# EAGLE design Nu2031 (EAGLE 7.7.0)

## Sheet 1 of 4
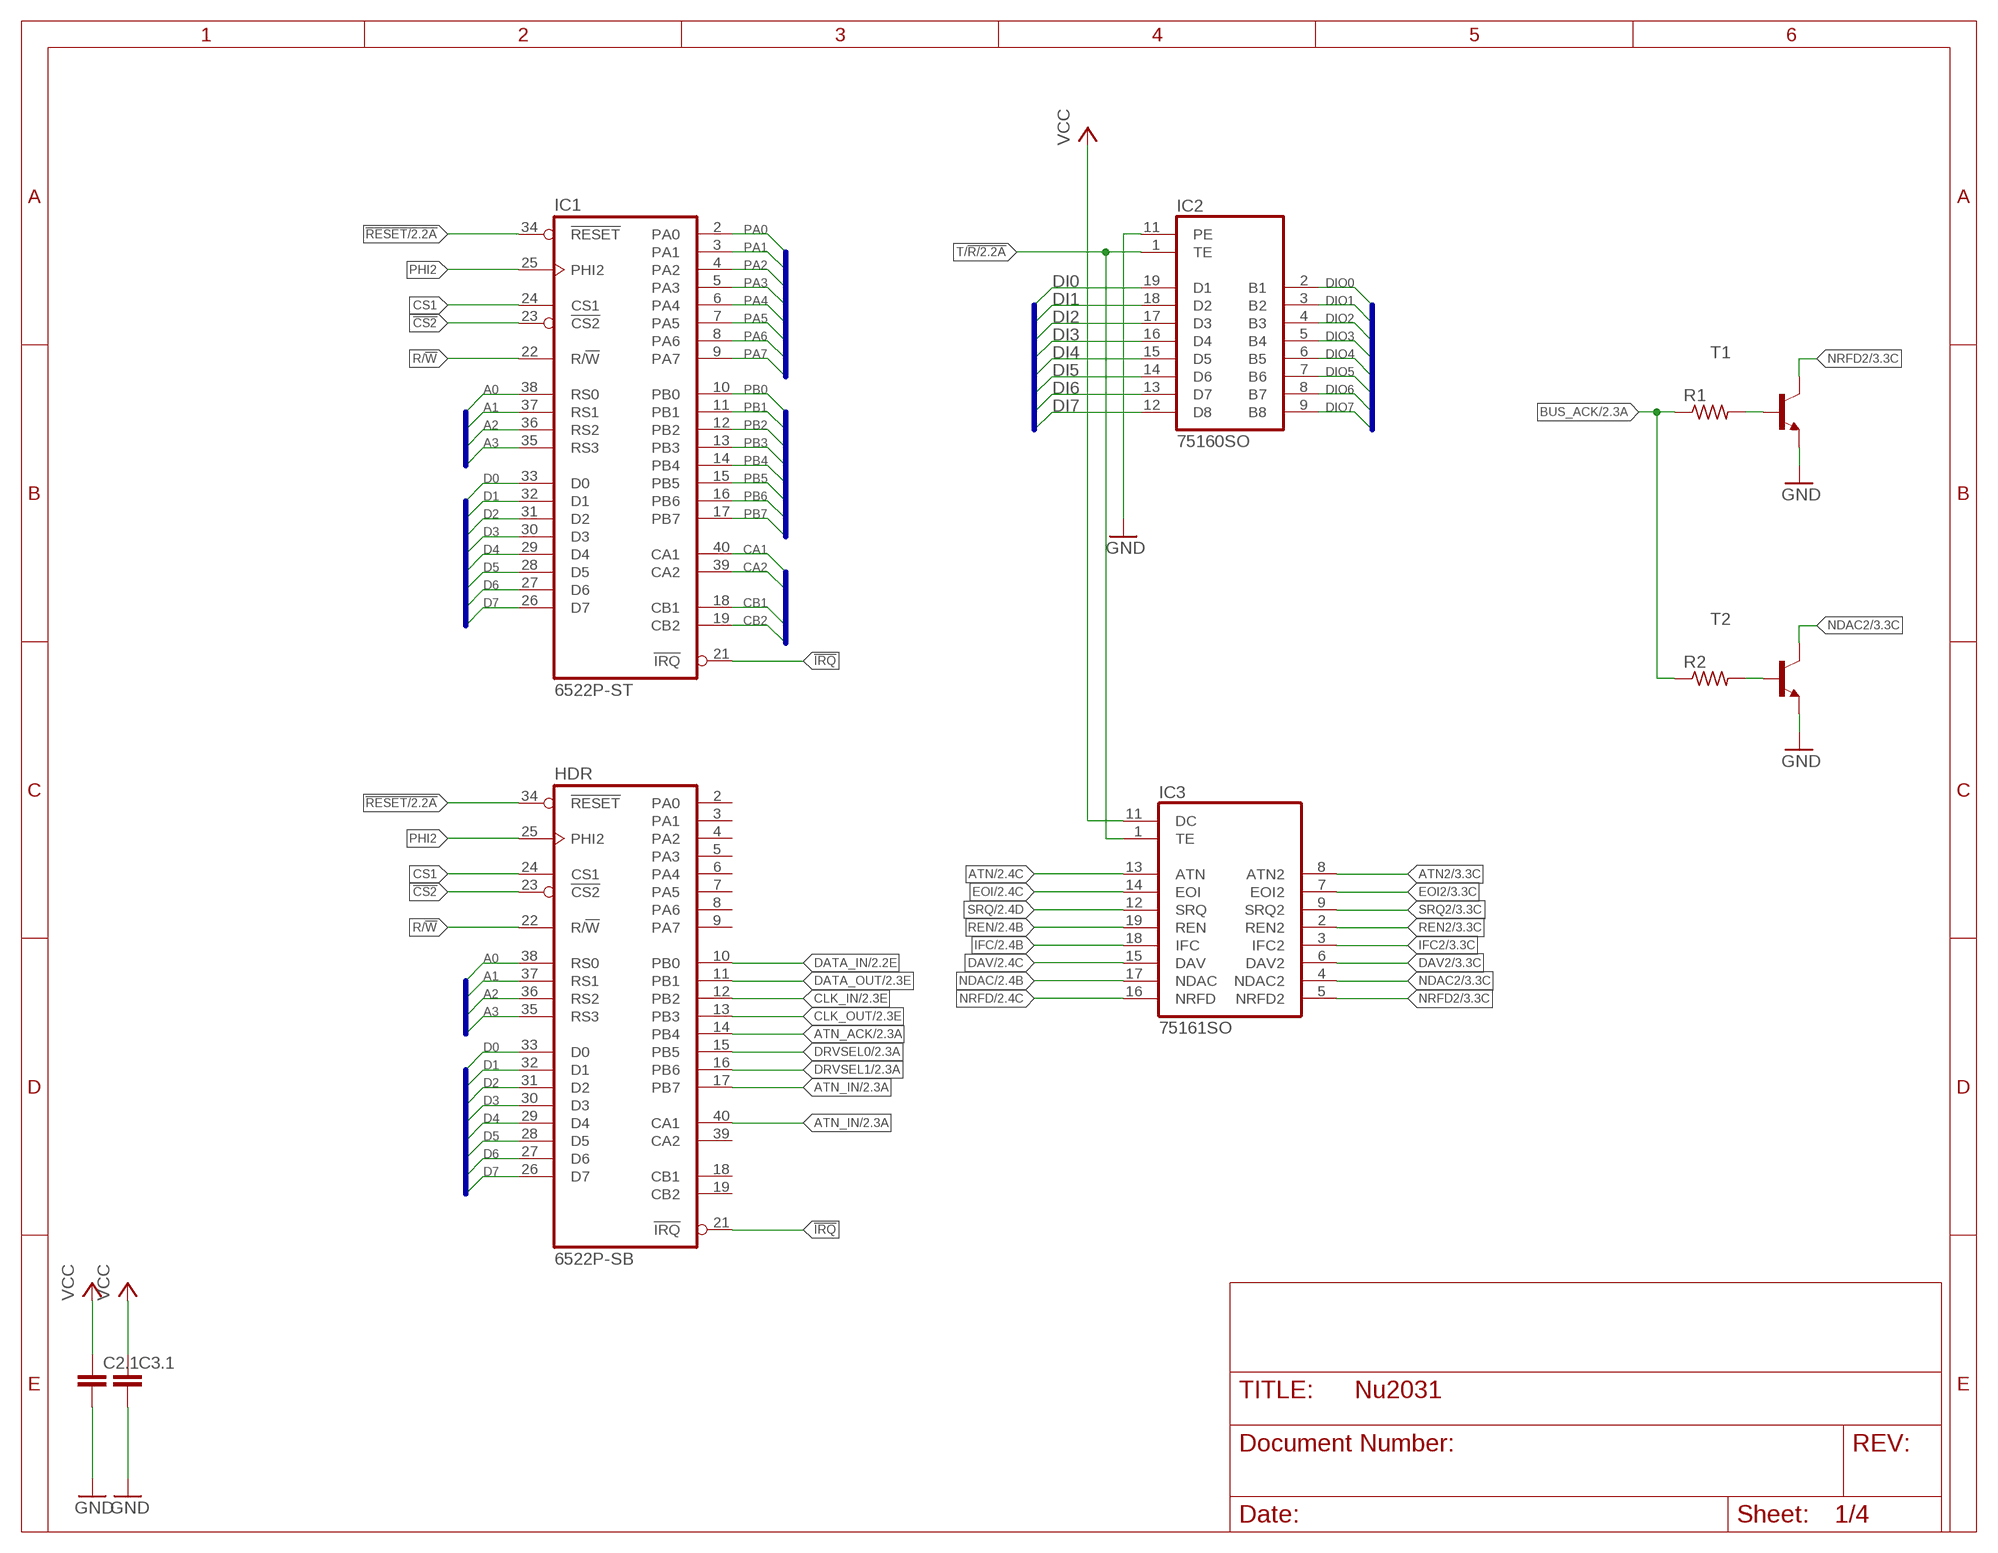
[diagram p0: schematic, sheet 1]

### Parts
C2.1  C-EUC0402  [C0402]
C3.1  C-EUC0402  [C0402]
HDR  6522P-SB  [DIL40-SMD-REVERSE]
IC1  6522P-ST  [DIL40-SMD]
IC2  75160SO  [SO20L]
IC3  75161SO  [SO20L]
R1  R-US_R0402  [R0402]
R2  R-US_R0402  [R0402]
T1  MMBT3904LT1-NPN-SOT23-BEC  [SOT23-BEC]
T2  MMBT3904LT1-NPN-SOT23-BEC  [SOT23-BEC]

### Nets
!CS2: HDR.23(!CS2) IC1.23(!CS2)
!IRQ: HDR.21(!IRQ) IC1.21(!IRQ)
!RESET: HDR.34(!RESET) IC1.34(!RESET) ; also sheet 2
A0: HDR.38(RS0) IC1.38(RS0)
A1: HDR.37(RS1) IC1.37(RS1)
A2: HDR.36(RS2) IC1.36(RS2)
A3: HDR.35(RS3) IC1.35(RS3)
ATN: IC3.13(ATN) ; also sheet 2
ATN2: IC3.8(ATN2) ; also sheet 3
ATN_ACK: HDR.14(PB4) ; also sheet 2
ATN_IN: HDR.17(PB7) HDR.40(CA1) ; also sheet 2
BUS_ACK: R1.1 R2.1 ; also sheet 2
CA1: IC1.40(CA1) ; also sheet 2
CA2: IC1.39(CA2) ; also sheet 2
CB1: IC1.18(CB1) ; also sheet 2
CB2: IC1.19(CB2) ; also sheet 2
CLK_IN: HDR.12(PB2) ; also sheet 2
CLK_OUT: HDR.13(PB3) ; also sheet 2
CS1: HDR.24(CS1) IC1.24(CS1)
D0: HDR.33(D0) IC1.33(D0)
D1: HDR.32(D1) IC1.32(D1)
D2: HDR.31(D2) IC1.31(D2)
D3: HDR.30(D3) IC1.30(D3)
D4: HDR.29(D4) IC1.29(D4)
D5: HDR.28(D5) IC1.28(D5)
D6: HDR.27(D6) IC1.27(D6)
D7: HDR.26(D7) IC1.26(D7)
DATA_IN: HDR.10(PB0) ; also sheet 2
DATA_OUT: HDR.11(PB1) ; also sheet 2
DAV: IC3.15(DAV) ; also sheet 2
DAV2: IC3.6(DAV2) ; also sheet 3
DI0: IC2.19(D1) ; also sheet 2
DI1: IC2.18(D2) ; also sheet 2
DI2: IC2.17(D3) ; also sheet 2
DI3: IC2.16(D4) ; also sheet 2
DI4: IC2.15(D5) ; also sheet 2
DI5: IC2.14(D6) ; also sheet 2
DI6: IC2.13(D7) ; also sheet 2
DI7: IC2.12(D8) ; also sheet 2
DIO0: IC2.2(B1) ; also sheet 3
DIO1: IC2.3(B2) ; also sheet 3
DIO2: IC2.4(B3) ; also sheet 3
DIO3: IC2.5(B4) ; also sheet 3
DIO4: IC2.6(B5) ; also sheet 3
DIO5: IC2.7(B6) ; also sheet 3
DIO6: IC2.8(B7) ; also sheet 3
DIO7: IC2.9(B8) ; also sheet 3
DRVSEL0: HDR.15(PB5) ; also sheet 2
DRVSEL1: HDR.16(PB6) ; also sheet 2
EOI: IC3.14(EOI) ; also sheet 2
EOI2: IC3.7(EOI2) ; also sheet 3
GND: C2.1.2 C3.1.2 IC2.11(PE) T1.E T2.E ; also sheet 2,3,4
IFC: IC3.18(IFC) ; also sheet 2
IFC2: IC3.3(IFC2) ; also sheet 3
N$3: R1.2 T1.B
N$4: R2.2 T2.B
NDAC: IC3.17(NDAC) ; also sheet 2
NDAC2: IC3.4(NDAC2) T2.C ; also sheet 3
NRFD: IC3.16(NRFD) ; also sheet 2
NRFD2: IC3.5(NRFD2) T1.C ; also sheet 3
PA0: IC1.2(PA0) ; also sheet 2
PA1: IC1.3(PA1) ; also sheet 2
PA2: IC1.4(PA2) ; also sheet 2
PA3: IC1.5(PA3) ; also sheet 2
PA4: IC1.6(PA4) ; also sheet 2
PA5: IC1.7(PA5) ; also sheet 2
PA6: IC1.8(PA6) ; also sheet 2
PA7: IC1.9(PA7) ; also sheet 2
PB0: IC1.10(PB0) ; also sheet 2
PB1: IC1.11(PB1) ; also sheet 2
PB2: IC1.12(PB2) ; also sheet 2
PB3: IC1.13(PB3) ; also sheet 2
PB4: IC1.14(PB4) ; also sheet 2
PB5: IC1.15(PB5) ; also sheet 2
PB6: IC1.16(PB6) ; also sheet 2
PB7: IC1.17(PB7) ; also sheet 2
PHI2: HDR.25(PHI2) IC1.25(PHI2)
R/!W: HDR.22(R/!W) IC1.22(R/!W)
REN: IC3.19(REN) ; also sheet 2
REN2: IC3.2(REN2) ; also sheet 3
SRQ: IC3.12(SRQ) ; also sheet 2
SRQ2: IC3.9(SRQ2) ; also sheet 3
T/!R: IC2.1(TE) IC3.1(TE) ; also sheet 2
VCC: C2.1.1 C3.1.1 IC3.11(DC) ; also sheet 2,4
Unconnected: HDR.2(PA0) HDR.3(PA1) HDR.4(PA2) HDR.5(PA3) HDR.6(PA4) HDR.7(PA5) HDR.8(PA6) HDR.9(PA7) HDR.18(CB1) HDR.19(CB2) HDR.39(CA2)

### Buses
A[0..3]
D[0..7]
PA[0..7]
PB[0..7]
CA[1..2],CB[1..2]
DI[0..7]
DIO[0..7]

## Sheet 2 of 4
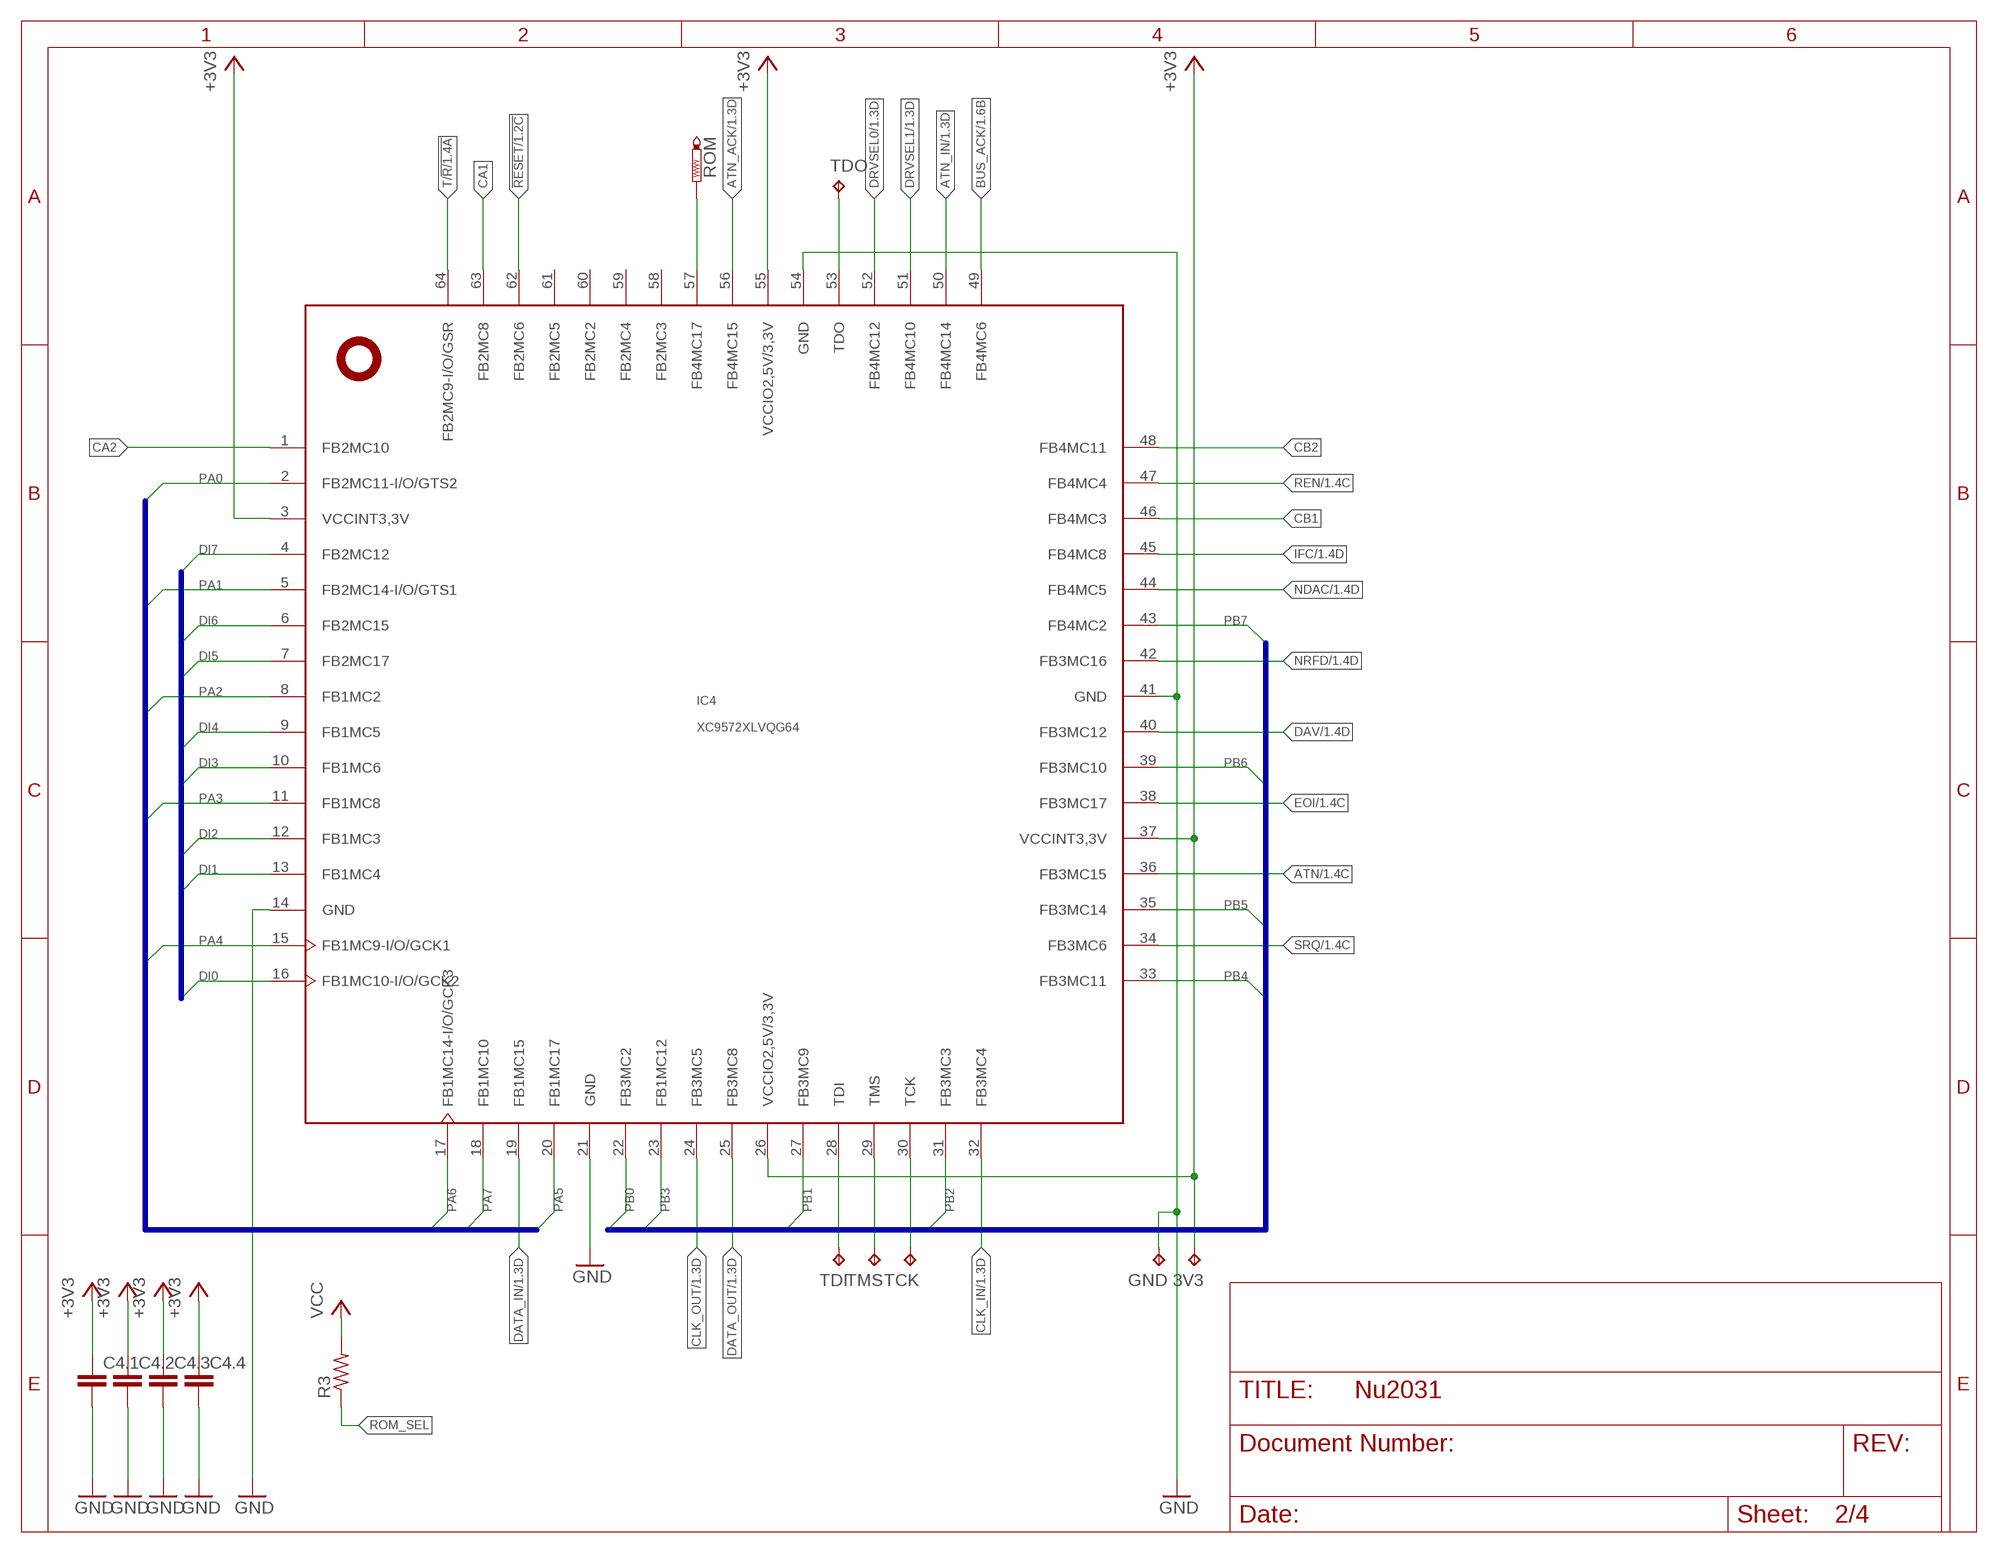
[diagram p1: schematic, sheet 2]

### Parts
3V3  TPTP10R  [TP10R]
C4.1  C-EUC0402  [C0402]
C4.2  C-EUC0402  [C0402]
C4.3  C-EUC0402  [C0402]
C4.4  C-EUC0402  [C0402]
GND  TPTP10R  [TP10R]
IC4  XC9572XLVQG64  [VQFP64]
R3  R-US_R0402  [R0402]
ROM  PTR1B1,27  [B1,27]
TCK  TPTP10R  [TP10R]
TDI  TPTP10R  [TP10R]
TDO  TPTP10R  [TP10R]
TMS  TPTP10R  [TP10R]

### Nets
!RESET: IC4.62(FB2MC6) ; also sheet 1
+3V3: 3V3.TP C4.1.1 C4.2.1 C4.3.1 C4.4.1 IC4.3(VCCINT3,3V) IC4.26(VCCIO2,5V/3,3V) IC4.37(VCCINT3,3V) IC4.55(VCCIO2,5V/3,3V) ; also sheet 4
ATN: IC4.36(FB3MC15) ; also sheet 1
ATN_ACK: IC4.56(FB4MC15) ; also sheet 1
ATN_IN: IC4.50(FB4MC14) ; also sheet 1
BUS_ACK: IC4.49(FB4MC6) ; also sheet 1
CA1: IC4.63(FB2MC8) ; also sheet 1
CA2: IC4.1(FB2MC10) ; also sheet 1
CB1: IC4.46(FB4MC3) ; also sheet 1
CB2: IC4.48(FB4MC11) ; also sheet 1
CLK_IN: IC4.32(FB3MC4) ; also sheet 1
CLK_OUT: IC4.24(FB3MC5) ; also sheet 1
DATA_IN: IC4.19(FB1MC15) ; also sheet 1
DATA_OUT: IC4.25(FB3MC8) ; also sheet 1
DAV: IC4.40(FB3MC12) ; also sheet 1
DI0: IC4.16(FB1MC10-I/O/GCK2) ; also sheet 1
DI1: IC4.13(FB1MC4) ; also sheet 1
DI2: IC4.12(FB1MC3) ; also sheet 1
DI3: IC4.10(FB1MC6) ; also sheet 1
DI4: IC4.9(FB1MC5) ; also sheet 1
DI5: IC4.7(FB2MC17) ; also sheet 1
DI6: IC4.6(FB2MC15) ; also sheet 1
DI7: IC4.4(FB2MC12) ; also sheet 1
DRVSEL0: IC4.52(FB4MC12) ; also sheet 1
DRVSEL1: IC4.51(FB4MC10) ; also sheet 1
EOI: IC4.38(FB3MC17) ; also sheet 1
GND: C4.1.2 C4.2.2 C4.3.2 C4.4.2 GND.TP IC4.14(GND) IC4.21(GND) IC4.41(GND) IC4.54(GND) ; also sheet 1,3,4
IFC: IC4.45(FB4MC8) ; also sheet 1
NDAC: IC4.44(FB4MC5) ; also sheet 1
NRFD: IC4.42(FB3MC16) ; also sheet 1
PA0: IC4.2(FB2MC11-I/O/GTS2) ; also sheet 1
PA1: IC4.5(FB2MC14-I/O/GTS1) ; also sheet 1
PA2: IC4.8(FB1MC2) ; also sheet 1
PA3: IC4.11(FB1MC8) ; also sheet 1
PA4: IC4.15(FB1MC9-I/O/GCK1) ; also sheet 1
PA5: IC4.20(FB1MC17) ; also sheet 1
PA6: IC4.17(FB1MC14-I/O/GCK3) ; also sheet 1
PA7: IC4.18(FB1MC10) ; also sheet 1
PB0: IC4.22(FB3MC2) ; also sheet 1
PB1: IC4.27(FB3MC9) ; also sheet 1
PB2: IC4.31(FB3MC3) ; also sheet 1
PB3: IC4.23(FB1MC12) ; also sheet 1
PB4: IC4.33(FB3MC11) ; also sheet 1
PB5: IC4.35(FB3MC14) ; also sheet 1
PB6: IC4.39(FB3MC10) ; also sheet 1
PB7: IC4.43(FB4MC2) ; also sheet 1
REN: IC4.47(FB4MC4) ; also sheet 1
ROM_SEL: IC4.57(FB4MC17) R3.1 ROM.TP
SRQ: IC4.34(FB3MC6) ; also sheet 1
T/!R: IC4.64(FB2MC9-I/O/GSR) ; also sheet 1
TCK: IC4.30(TCK) TCK.TP
TDI: IC4.28(TDI) TDI.TP
TDO: IC4.53(TDO) TDO.TP
TMS: IC4.29(TMS) TMS.TP
VCC: R3.2 ; also sheet 1,4
Unconnected: IC4.58(FB2MC3) IC4.59(FB2MC4) IC4.60(FB2MC2) IC4.61(FB2MC5)

### Buses
DI[0..7]
PA[0..7]
PB[0..7]

## Sheet 3 of 4
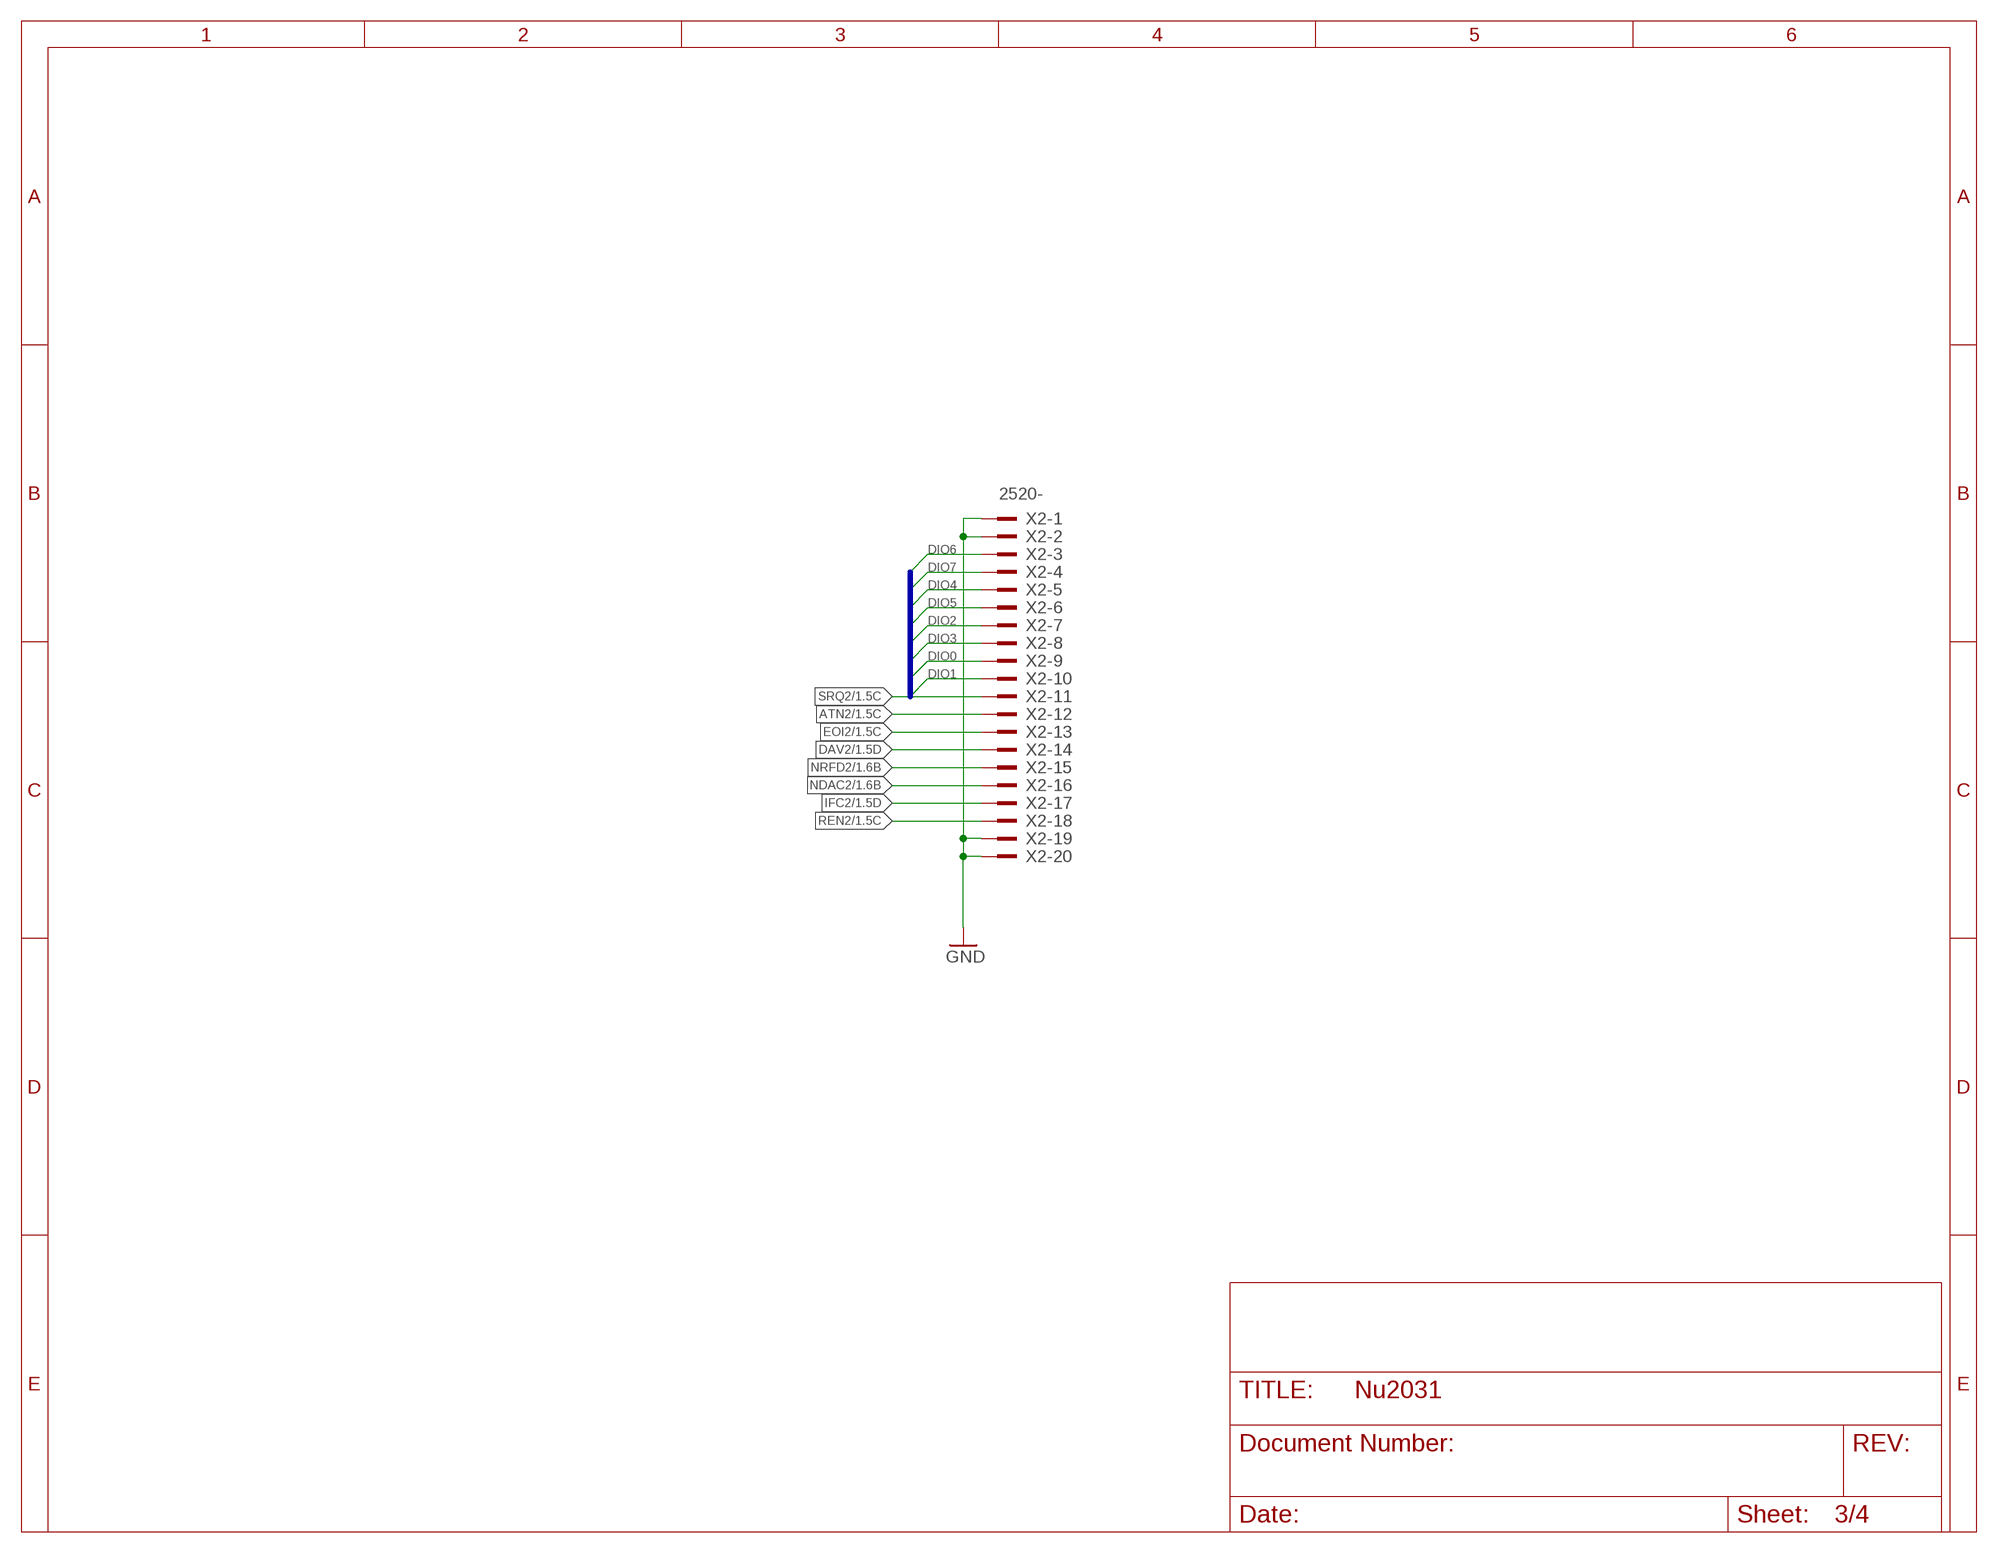
[diagram p2: schematic, sheet 3]

### Parts
X2  2520-  [PAK100/2500-20]

### Nets
ATN2: X2.12 ; also sheet 1
DAV2: X2.14 ; also sheet 1
DIO0: X2.9 ; also sheet 1
DIO1: X2.10 ; also sheet 1
DIO2: X2.7 ; also sheet 1
DIO3: X2.8 ; also sheet 1
DIO4: X2.5 ; also sheet 1
DIO5: X2.6 ; also sheet 1
DIO6: X2.3 ; also sheet 1
DIO7: X2.4 ; also sheet 1
EOI2: X2.13 ; also sheet 1
GND: X2.1 X2.2 X2.19 X2.20 ; also sheet 1,2,4
IFC2: X2.17 ; also sheet 1
NDAC2: X2.16 ; also sheet 1
NRFD2: X2.15 ; also sheet 1
REN2: X2.18 ; also sheet 1
SRQ2: X2.11 ; also sheet 1

### Buses
DIO[0..7]

## Sheet 4 of 4
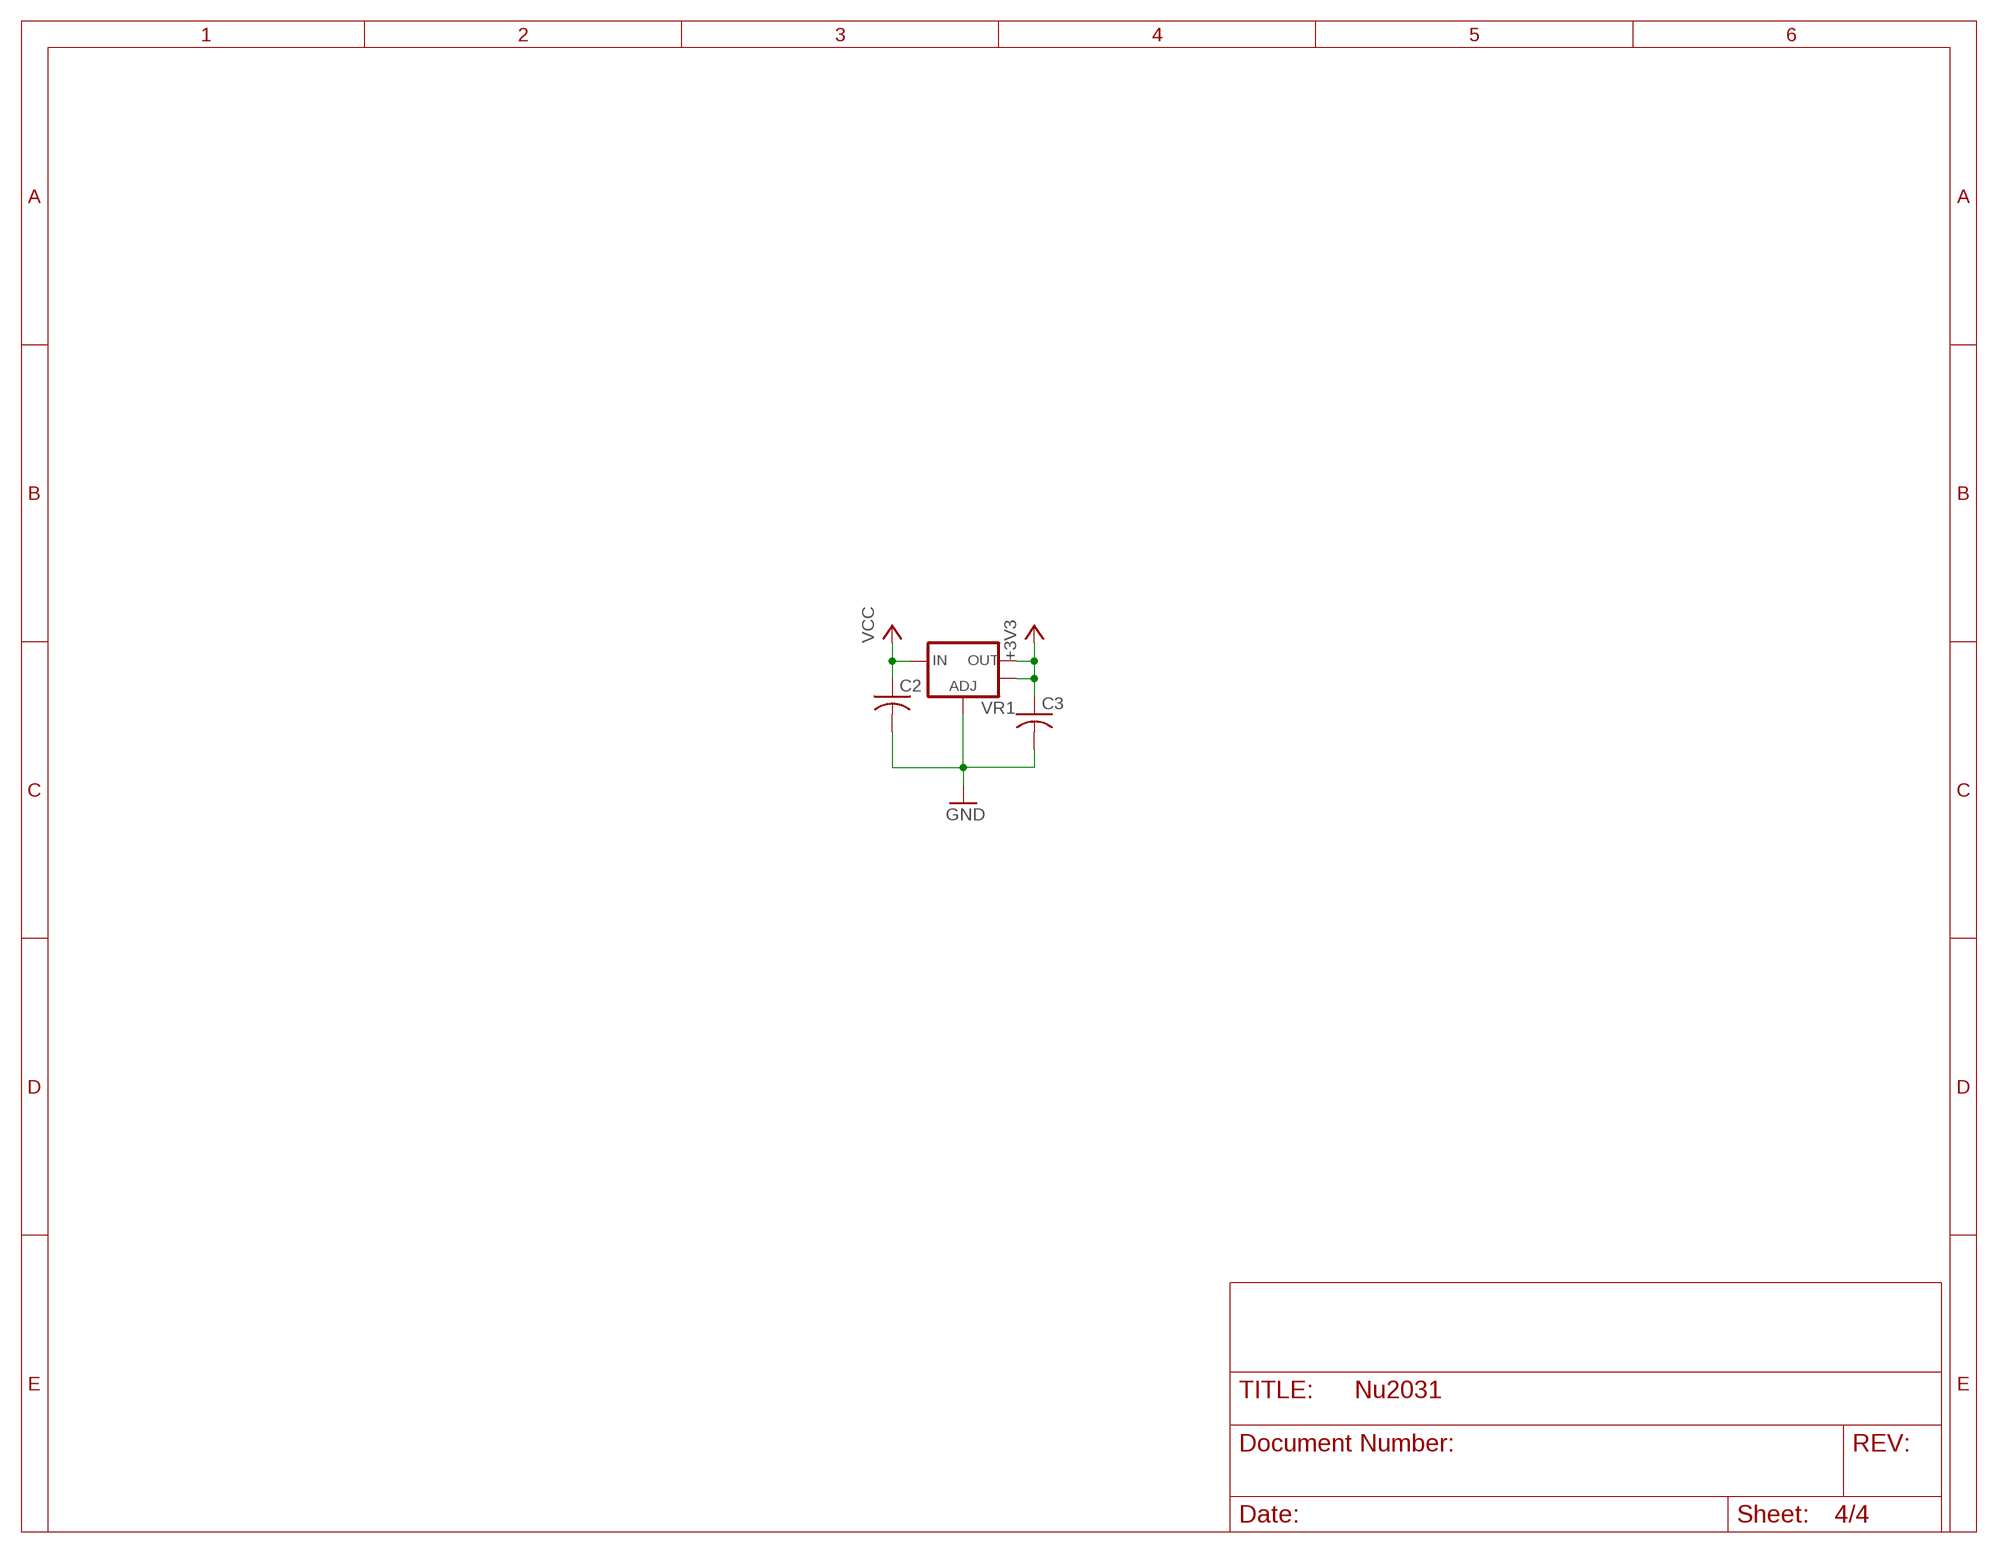
[diagram p3: schematic, sheet 4]

### Parts
C2  C-USC0805  [C0805]
C3  C-USC0805  [C0805]
VR1  V_REG_LM1117SOT223  [SOT223]

### Nets
+3V3: C3.1 VR1.2(OUT) VR1.4(OUT) ; also sheet 2
GND: C2.2 C3.2 VR1.1(ADJ) ; also sheet 1,2,3
VCC: C2.1 VR1.3(IN) ; also sheet 1,2

## Power pins joined to a net without a drawn wire
GND: HDR.1(GND) IC1.1(GND) IC2.10(GND) IC3.10(GND)
VCC: HDR.20(VCC) IC1.20(VCC) IC2.20(VCC) IC3.20(VCC)

## Library data of the parts
3V3 GND TCK TDI TDO TMS = testpad:TP: Test pad
C2 C3 = rcl:C-US: CAPACITOR, American symbol
C2.1 C3.1 C4.1-C4.4 = rcl:C-EU: CAPACITOR, European symbol
HDR IC1 = commodore:65*22: MOS TECHNOLOGY 6522 VERSATILE INTERFACE ADAPTER (VIA) Information taken from 6522 datasheet (nov '77) I/O device: two 8-bits ports, handshake lines, timers.
IC2 = 751xx:75160: 75xxx DEVICE
IC3 = 751xx:75161: 75xxx DEVICE
IC4 = xilinx_xc95XXXxl:XC9572XLVQG64
R1-R3 = resistor:R-US_: RESISTOR, American symbol
ROM = testpad:PTR1: TEST PIN
T1 T2 = transistor:*-NPN-: NPN Transistror BF959 corrected 2008.03.06
VR1 = SparkFun:V_REG_LM1117: Voltage Regulator LM1117 Standard adjustable voltage regulator but in SMD form. Spark Fun Electronics SKU : COM-00595
X2 = con-3m:2520-: 3M (TM) Pak 100 4-Wall Header Source: 3M; OC_FARNELL: unknown; OC_NEWARK: unknown

## Board
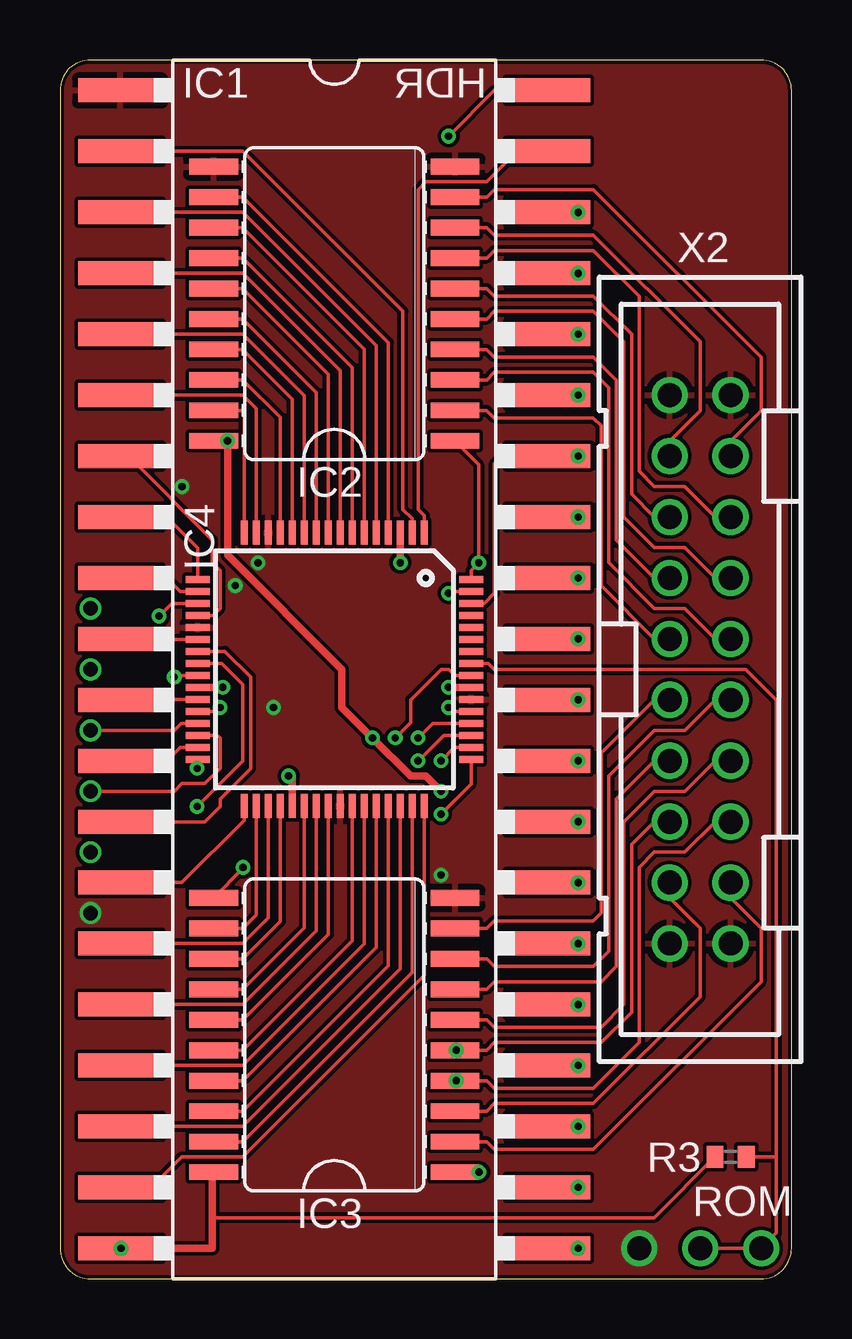
[diagram p4: board, top side]
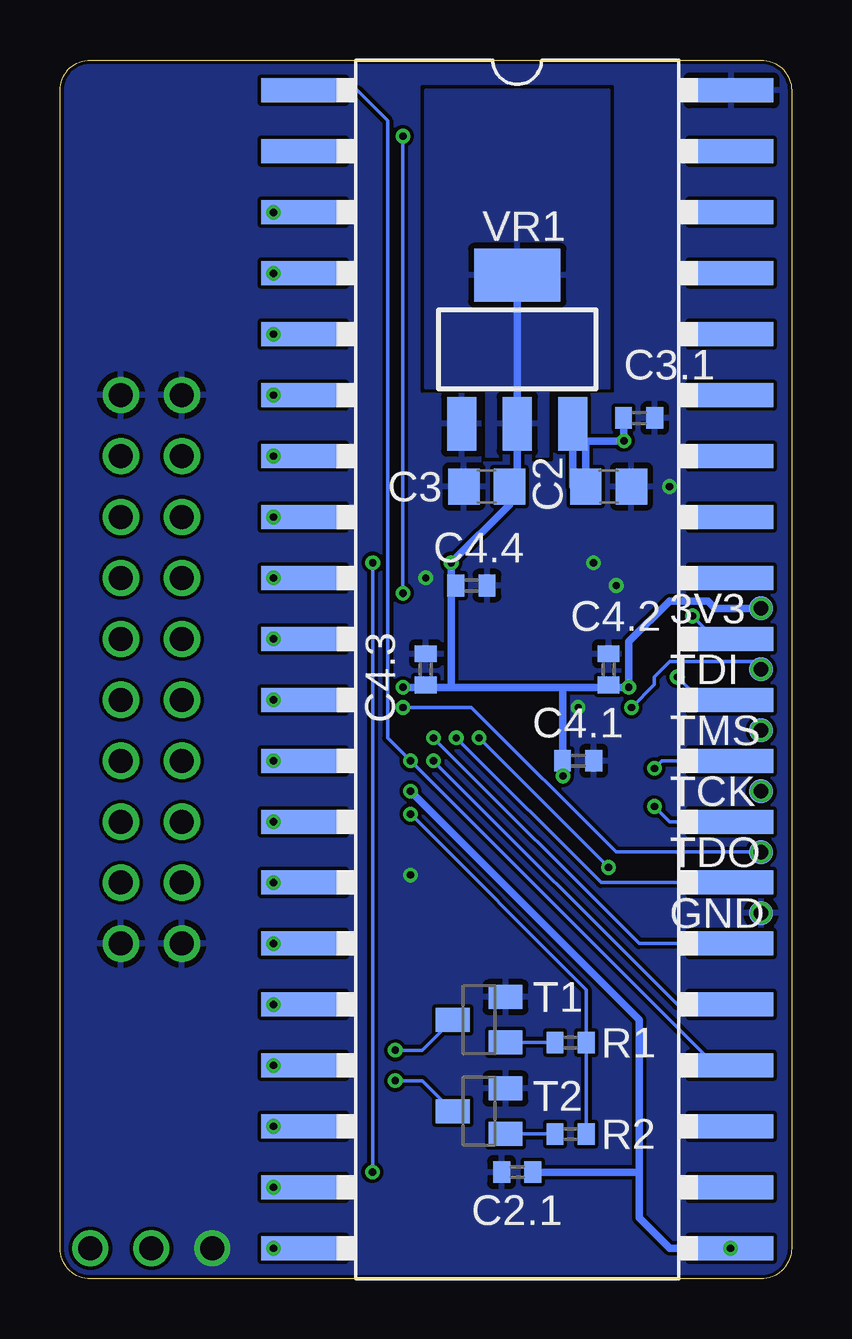
[diagram p5: board, bottom side, seen from below]

Size 30.48 x 50.8 mm. Coordinates in mm from the lower left corner, seen from the top.
Outline: 29.21,50.8 1.27,50.8 arc90 0,49.53 0,1.27 arc90 1.27,0 29.21,0 arc90 30.48,1.27 30.48,49.53 arc90 29.21,50.8
Copper layers (1*16): Top 0.035mm / dielectric 1.5mm / Bottom 0.035mm
Design rules "hackvana *": minimum track width 6mil, minimum drill 0.3mm, track to track 6mil, track to pad 6mil, pad to pad 6mil, via to via 6mil, smd to smd 0mil, copper to edge 6mil, drill to drill 6mil, minimum pad ring 10mil, minimum via ring 6mil, stop-mask expansion 2mil, vias tented up to drill 100mil, thermal gap 10mil

### Footprints (pad centres in the part's own frame; a part is rotated, then mirrored left to right if it is on the bottom)
TP10R = smd 1 x 1: TP 0,0
C0805 = smd 1.3 x 1.5: 1 -0.95,0; 2 0.95,0
C0402 = smd 0.7 x 0.9: 1 -0.65,0; 2 0.65,0
DIL40-SMD-REVERSE = smd 1 x 3.5 bottom: 1 -24.13,-8.92; 2 -21.59,-8.92; 3 -19.05,-8.92; 4 -16.51,-8.92; 5 -13.97,-8.92; 6 -11.43,-8.92; 7 -8.89,-8.92; 8 -6.35,-8.92; 9 -3.81,-8.92; 10 -1.27,-8.92; 11 1.27,-8.92; 12 3.81,-8.92; 13 6.35,-8.92; 14 8.89,-8.92; 15 11.43,-8.92; 16 13.97,-8.92; 17 16.51,-8.92; 18 19.05,-8.92; 19 21.59,-8.92; 20 24.13,-8.92; 21 24.13,8.92; 22 21.59,8.92; 23 19.05,8.92; 24 16.51,8.92; 25 13.97,8.92; 26 11.43,8.92; 27 8.89,8.92; 28 6.35,8.92; 29 3.81,8.92; 30 1.27,8.92; 31 -1.27,8.92; 32 -3.81,8.92; 33 -6.35,8.92; 34 -8.89,8.92; 35 -11.43,8.92; 36 -13.97,8.92; 37 -16.51,8.92; 38 -19.05,8.92; 39 -21.59,8.92; 40 -24.13,8.92
DIL40-SMD = smd 1 x 3.5: 1 -24.13,-8.92; 2 -21.59,-8.92; 3 -19.05,-8.92; 4 -16.51,-8.92; 5 -13.97,-8.92; 6 -11.43,-8.92; 7 -8.89,-8.92; 8 -6.35,-8.92; 9 -3.81,-8.92; 10 -1.27,-8.92; 11 1.27,-8.92; 12 3.81,-8.92; 13 6.35,-8.92; 14 8.89,-8.92; 15 11.43,-8.92; 16 13.97,-8.92; 17 16.51,-8.92; 18 19.05,-8.92; 19 21.59,-8.92; 20 24.13,-8.92; 21 24.13,8.92; 22 21.59,8.92; 23 19.05,8.92; 24 16.51,8.92; 25 13.97,8.92; 26 11.43,8.92; 27 8.89,8.92; 28 6.35,8.92; 29 3.81,8.92; 30 1.27,8.92; 31 -1.27,8.92; 32 -3.81,8.92; 33 -6.35,8.92; 34 -8.89,8.92; 35 -11.43,8.92; 36 -13.97,8.92; 37 -16.51,8.92; 38 -19.05,8.92; 39 -21.59,8.92; 40 -24.13,8.92
SO20L = smd 0.66 x 2.032: 1 -5.715,-5.029; 2 -4.445,-5.029; 3 -3.175,-5.029; 4 -1.905,-5.029; 5 -0.635,-5.029; 6 0.635,-5.029; 7 1.905,-5.029; 8 3.175,-5.029; 9 4.445,-5.029; 10 5.715,-5.029; 11 5.715,5.029; 12 4.445,5.029; 13 3.175,5.029; 14 1.905,5.029; 15 0.635,5.029; 16 -0.635,5.029; 17 -1.905,5.029; 18 -3.175,5.029; 19 -4.445,5.029; 20 -5.715,5.029
VQFP64 = smd 1 x 0.3: 1 -5.7,3.75; 2 -5.7,3.25; 3 -5.7,2.75; 4 -5.7,2.25; 5 -5.7,1.75; 6 -5.7,1.25; 7 -5.7,0.75; 8 -5.7,0.25; 9 -5.7,-0.25; 10 -5.7,-0.75; 11 -5.7,-1.25; 12 -5.7,-1.75; 13 -5.7,-2.25; 14 -5.7,-2.75; 15 -5.7,-3.25; 16 -5.7,-3.75; 33 5.7,-3.75; 34 5.7,-3.25; 35 5.7,-2.75; 36 5.7,-2.25; 37 5.7,-1.75; 38 5.7,-1.25; 39 5.7,-0.75; 40 5.7,-0.25; 41 5.7,0.25; 42 5.7,0.75; 43 5.7,1.25; 44 5.7,1.75; 45 5.7,2.25; 46 5.7,2.75; 47 5.7,3.25; 48 5.7,3.75 | smd 0.3 x 1: 17 -3.75,-5.7; 18 -3.25,-5.7; 19 -2.75,-5.7; 20 -2.25,-5.7; 21 -1.75,-5.7; 22 -1.25,-5.7; 23 -0.75,-5.7; 24 -0.25,-5.7; 25 0.25,-5.7; 26 0.75,-5.7; 27 1.25,-5.7; 28 1.75,-5.7; 29 2.25,-5.7; 30 2.75,-5.7; 31 3.25,-5.7; 32 3.75,-5.7; 49 3.75,5.7; 50 3.25,5.7; 51 2.75,5.7; 52 2.25,5.7; 53 1.75,5.7; 54 1.25,5.7; 55 0.75,5.7; 56 0.25,5.7; 57 -0.25,5.7; 58 -0.75,5.7; 59 -1.25,5.7; 60 -1.75,5.7; 61 -2.25,5.7; 62 -2.75,5.7; 63 -3.25,5.7; 64 -3.75,5.7
R0402 = smd 0.7 x 0.9: 1 -0.65,0; 2 0.65,0
B1,27 = smd 1.27 x 1.27: TP 0,0
SOT23-BEC = smd 1 x 1.4: B -0.95,-1.1; C 0,1.1; E 0.95,-1.1
SOT223 = smd 1.219 x 2.235: 1 -2.311,-3.099; 2 0,-3.099; 3 2.311,-3.099 | smd 3.6 x 2.2: 4 0,3.099
PAK100/2500-20 = drill 1 pad 1.422: 1 -11.43,-1.27; 2 -11.43,1.27; 3 -8.89,-1.27; 4 -8.89,1.27; 5 -6.35,-1.27; 6 -6.35,1.27; 7 -3.81,-1.27; 8 -3.81,1.27; 9 -1.27,-1.27; 10 -1.27,1.27; 11 1.27,-1.27; 12 1.27,1.27; 13 3.81,-1.27; 14 3.81,1.27; 15 6.35,-1.27; 16 6.35,1.27; 17 8.89,-1.27; 18 8.89,1.27; 19 11.43,-1.27; 20 11.43,1.27

### Placement (x,y rotation side)
3V3  1.27,27.94 0 bottom
C2  7.62,33.02 0 bottom
C2.1  11.43,4.45 180 bottom
C3  12.7,33.02 180 bottom
C3.1  6.35,35.88 0 bottom
C4.1  8.89,21.59 0 bottom
C4.2  7.62,25.4 90 bottom
C4.3  15.24,25.4 90 bottom
C4.4  13.34,28.89 0 bottom
GND  1.27,15.24 0 bottom
HDR  11.43,25.4 270 top
IC1  11.43,25.4 270 top
IC2  11.43,40.64 90 top
IC3  11.43,10.16 90 top
IC4  11.43,25.4 270 top
R1  9.21,9.84 180 bottom
R2  9.21,6.03 180 bottom
R3  27.94,5.08 180 top
ROM  29.21,1.27 0 top
T1  13.02,10.79 90 bottom
T2  13.02,6.99 90 bottom
TCK  1.27,20.32 0 bottom
TDI  1.27,25.4 0 bottom
TDO  1.27,17.78 0 bottom
TMS  1.27,22.86 0 bottom
VR1  11.43,38.73 0 bottom
X2  26.67,25.4 270 top

### Tracks (layer width: path | path; a pad name or v marks a point on that pad's centre or on a via)
!CS2  (via drill 0.3)
  Top 0.152: v21.59,6.35 HDR.23
  Bottom 0.152: HDR.23 v21.59,6.35
!IRQ  (via drill 0.3)
  Top 0.152: HDR.21 v21.59,1.27
  Bottom 0.152: HDR.21 v21.59,1.27
!RESET  (via drill 0.3)
  Top 0.152: v21.59,34.29 HDR.34 18.41,34.29 18.1,33.97 18.1,28.57 17.67,28.15 IC4.62
  Bottom 0.152: v21.59,34.29 HDR.34
+3V3  (via drill 0.3, 0.61)
  Top 0.305: IC4.26 v6.78,24.65 | IC4.37 9.68,20.95 v9.53,20.95 | IC4.3 v14.18,29.84 | v16.19,24.65 IC4.55
  Bottom 0.305: v9.53,20.95 9.53,21.59 | 9.53,21.59 9.53,24.65 | 7.62,24.65 v6.78,24.65 6.78,26.55 5.08,28.26 3.49,28.26 3.17,27.94 3V3.TP | 7.62,24.65 9.53,24.65 | 9.53,24.65 14.18,24.65 | 14.18,24.65 15.24,24.65 | 15.24,24.65 v16.19,24.65 | 14.18,29.21 v14.18,29.84 11.75,32.27 C3.1 11.43,33.02 VR1.2 VR1.4 | 14.18,29.21 14.18,24.65 | C4.4.1 13.98,29.02 14.18,29.21 | C4.3.1 15.24,24.65 | C4.1.1 9.53,21.59 | C4.2.1 7.62,24.65
  other vias: 1.27,27.94
  pour Bottom: 7.62,49.53 15.24,49.53 15.24,37.15 12.7,37.15 12.7,34.29 10.16,34.29 10.16,37.15 7.62,37.15
A0  (via drill 0.3)
  Top 0.152: HDR.38 v21.59,44.45
  Bottom 0.152: v21.59,44.45 HDR.38
A1  (via drill 0.3)
  Top 0.152: v21.59,41.91 HDR.37
  Bottom 0.152: HDR.37 v21.59,41.91
A2  (via drill 0.3)
  Top 0.152: HDR.36 v21.59,39.37
  Bottom 0.152: v21.59,39.37 HDR.36
A3  (via drill 0.3)
  Top 0.152: v21.59,36.83 HDR.35
  Bottom 0.152: HDR.35 v21.59,36.83
ATN
  Top 0.152: IC3.13 7.62,13.34 9.18,14.89 IC4.36
ATN2
  Top 0.152: IC3.8 17.78,13.34 18.1,13.02 22.23,13.02 22.86,13.65 22.86,20.95 24.77,22.86 26.04,22.86 27.3,24.13 X2.12
ATN_ACK  (via drill 0.3)
  Top 0.152: v13.97,22.54 14.61,23.18 14.61,24.13 15.88,25.4 16.19,25.4 16.44,25.15 IC4.56
  Bottom 0.152: HDR.14 7.94,16.51 v13.97,22.54
ATN_IN  (via drill 0.3)
  Top 0.152: 15.94,21.65 v15.88,21.59 16.43,22.15 IC4.50
  Bottom 0.152: HDR.40 18.1,49.53 16.83,48.26 16.83,22.54 v15.88,21.59 3.17,8.89 HDR.17
BUS_ACK  (via drill 0.3)
  Top 0.152: IC4.49 17.13,20.62 v15.88,19.37
  Bottom 0.152: v15.88,19.37 8.56,12.05 R1.1 R2.1
CA1  (via drill 0.3)
  Top 0.152: IC1.40 18.1,49.53 v16.19,47.62 | IC4.63 16.27,28.65 v16.19,28.57
  Bottom 0.152: v16.19,28.57 v16.19,47.62
CA2
  Top 0.152: IC1.39 19.05,46.99 17.78,45.72 15.24,45.72 14.92,45.4 14.92,32.07 15.18,31.81 IC4.1
CB1
  Top 0.152: IC1.18 7.62,6.35 14.18,12.91 IC4.46
CB2
  Top 0.152: IC1.19 3.81,3.81 5.08,5.08 7.62,5.08 15.18,12.64 IC4.48
CLK_IN  (via drill 0.3)
  Top 0.152: IC4.32 5.73,21.29 v5.71,21.27
  Bottom 0.152: v5.71,21.27 5.4,21.59 HDR.12
CLK_OUT  (via drill 0.3)
  Top 0.152: v5.71,19.68 7.62,21.59 7.62,24.77 6.74,25.65 IC4.24
  Bottom 0.152: HDR.13 5.08,19.05 v5.71,19.68
CS1  (via drill 0.3)
  Top 0.152: HDR.24 v21.59,8.89
  Bottom 0.152: v21.59,8.89 HDR.24
D0  (via drill 0.3)
  Top 0.152: v21.59,31.75 HDR.33
  Bottom 0.152: HDR.33 v21.59,31.75
D1  (via drill 0.3)
  Top 0.152: HDR.32 v21.59,29.21
  Bottom 0.152: v21.59,29.21 HDR.32
D2  (via drill 0.3)
  Top 0.152: v21.59,26.67 HDR.31
  Bottom 0.152: HDR.31 v21.59,26.67
D3  (via drill 0.3)
  Top 0.152: HDR.30 v21.59,24.13
  Bottom 0.152: v21.59,24.13 HDR.30
D4  (via drill 0.3)
  Top 0.152: v21.59,21.59 HDR.29
  Bottom 0.152: HDR.29 v21.59,21.59
D5  (via drill 0.3)
  Top 0.152: HDR.28 v21.59,19.05
  Bottom 0.152: v21.59,19.05 HDR.28
D6  (via drill 0.3)
  Top 0.152: v21.59,16.51 HDR.27
  Bottom 0.152: HDR.27 v21.59,16.51
D7  (via drill 0.3)
  Top 0.152: HDR.26 v21.59,13.97
  Bottom 0.152: v21.59,13.97 HDR.26
DATA_IN  (via drill 0.3)
  Top 0.152: IC4.19 4.66,28.15 v4.13,27.62
  Bottom 0.152: v4.13,27.62 3.17,26.67 HDR.10
DATA_OUT  (via drill 0.3)
  Top 0.152: IC4.25 4.83,25.15 v4.76,25.08
  Bottom 0.152: v4.76,25.08 3.81,24.13 HDR.11
DAV
  Top 0.152: IC3.15 7.62,10.79 11.18,14.36 IC4.40
DAV2
  Top 0.152: IC3.6 17.78,10.79 18.1,10.48 22.54,10.48 23.5,11.43 23.5,19.05 24.77,20.32 26.04,20.32 27.3,21.59 X2.14
DI0
  Top 0.152: IC2.19 7.62,36.2 7.68,36.13 IC4.16
DI1
  Top 0.152: IC2.18 7.62,37.47 9.18,35.91 IC4.13
DI2
  Top 0.152: IC2.17 7.62,38.73 9.68,36.67 IC4.12
DI3
  Top 0.152: IC2.16 7.62,40.01 10.68,36.95 IC4.10
DI4
  Top 0.152: IC2.15 7.62,41.27 11.18,37.72 IC4.9
DI5
  Top 0.152: IC2.14 7.62,42.55 12.18,37.98 IC4.7
DI6
  Top 0.152: IC2.13 7.62,43.81 12.68,38.76 IC4.6
DI7
  Top 0.152: IC2.12 7.62,45.09 13.68,39.02 IC4.4
DIO0
  Top 0.152: IC2.2 17.78,36.2 18.1,35.88 22.23,35.88 22.54,35.56 22.54,28.89 24.77,26.67 X2.9
DIO1
  Top 0.152: IC2.3 17.78,37.47 18.1,37.78 22.23,37.78 22.86,37.15 22.86,29.84 24.77,27.94 26.04,27.94 27.3,26.67 X2.10
DIO2
  Top 0.152: IC2.4 17.78,38.73 18.1,38.42 22.23,38.42 23.18,37.47 23.18,30.8 24.77,29.21 X2.7
DIO3
  Top 0.152: IC2.5 17.78,40.01 18.1,40.32 22.23,40.32 23.5,39.05 23.5,31.75 24.77,30.48 26.04,30.48 27.3,29.21 X2.8
DIO4
  Top 0.152: IC2.6 17.78,41.27 18.1,40.96 22.23,40.96 23.81,39.37 23.81,32.7 24.77,31.75 X2.5
DIO5
  Top 0.152: IC2.7 17.78,42.55 18.1,42.86 22.23,42.86 24.13,40.96 24.13,33.66 24.77,33.02 26.04,33.02 27.3,31.75 X2.6
DIO6
  Top 0.152: IC2.8 17.78,43.81 18.1,43.5 22.23,43.5 26.67,39.05 26.67,36.2 25.4,34.92 X2.3
DIO7
  Top 0.152: IC2.9 17.78,45.09 18.1,45.4 22.23,45.4 29.21,38.42 29.21,36.2 27.94,34.92 X2.4
DRVSEL0  (via drill 0.3)
  Top 0.152: 15.03,22.65 v14.92,22.54 15.53,23.15 IC4.52
  Bottom 0.152: HDR.15 6.35,13.97 v14.92,22.54
DRVSEL1  (via drill 0.3)
  Top 0.152: v14.92,21.59 15.98,22.65 IC4.51
  Bottom 0.152: HDR.16 4.76,11.43 v14.92,21.59
EOI
  Top 0.152: IC3.14 7.62,12.06 10.18,14.62 IC4.38
EOI2
  Top 0.152: IC3.7 17.78,12.06 18.1,12.38 22.54,12.38 23.18,13.02 23.18,20 24.77,21.59 X2.13
GND  (via drill 0.3, 0.61, 1)
  other vias: 7.3,28.89 8.26,29.84 15.24,29.21 5.08,33.02 15.88,16.83 24.13,1.27 1.27,15.24 8.89,23.81
  pour Top (rank 2): 0,1.27 0,49.53 arc-90 1.27,50.8 29.21,50.8 arc-90 30.48,49.53 30.48,1.27 arc-90 29.21,0 1.27,0 arc-90
  pour Bottom (rank 2): 1.27,50.8 arc90 0,49.53 0,1.27 arc90 1.27,0 29.21,0 arc90 30.48,1.27 30.48,49.53 arc90 29.21,50.8
IFC
  Top 0.152: IC3.18 7.62,6.99 13.68,13.04 IC4.45
IFC2
  Top 0.152: IC3.3 17.78,6.99 18.1,7.3 22.23,7.3 26.67,11.75 26.67,14.61 25.4,15.88 X2.17
N$3
  Bottom 0.152: R1.2 T1.B
N$4
  Bottom 0.152: T2.B R2.2
NDAC
  Top 0.152: IC3.17 7.62,8.26 13.18,13.81 IC4.44
NDAC2  (via drill 0.3)
  Top 0.152: IC3.4 v16.51,8.26 17.78,8.26 18.1,7.94 22.23,7.94 24.13,9.84 24.13,17.14 24.77,17.78 26.04,17.78 27.3,19.05 X2.16
  Bottom 0.152: T2.C 15.39,8.26 v16.51,8.26
NRFD
  Top 0.152: IC3.16 7.62,9.53 12.18,14.09 IC4.42
NRFD2  (via drill 0.3)
  Top 0.152: v16.51,9.53 IC3.5 17.78,9.53 18.1,9.84 22.54,9.84 23.81,11.11 23.81,18.1 24.77,19.05 X2.15
  Bottom 0.152: T1.C 15.39,9.53 v16.51,9.53
PA0
  Top 0.152: IC1.2 7.62,46.99 14.29,40.32 14.29,32.07 14.68,31.68 IC4.2
PA1
  Top 0.152: IC1.3 7.62,44.45 13.18,38.89 IC4.5
PA2
  Top 0.152: IC1.4 7.62,41.91 11.68,37.85 IC4.8
PA3
  Top 0.152: IC1.5 7.62,39.37 10.18,36.81 IC4.11
PA4
  Top 0.152: IC1.6 7.62,36.83 8.18,36.27 IC4.15
PA5
  Top 0.152: IC1.7 2.86,34.29 6.35,30.8 6.35,29.84 6.67,29.53 6.67,27.94 6.38,27.65 IC4.20
PA6
  Top 0.152: IC4.17 5.73,30.46 4.45,31.75 IC1.8
PA7
  Top 0.152: IC4.18 5,28.65 4.45,29.21 IC1.9
PB0
  Top 0.152: 4.13,26.67 IC1.10 2.53,26.65 IC4.22
PB1
  Top 0.152: IC4.27 2.53,24.15 IC1.11
PB2
  Top 0.152: IC4.31 5,22.15 4.45,21.59 IC1.12
PB3
  Top 0.152: IC1.13 6.03,19.05 6.67,19.68 6.67,20 7.94,21.27 7.94,25.08 6.87,26.15 IC4.23
PB4
  Top 0.152: IC1.14 5.08,16.51 7.68,19.11 IC4.33
PB5
  Top 0.152: IC1.15 7.62,13.97 8.68,15.03 IC4.35
PB6
  Top 0.152: IC1.16 7.62,11.43 10.68,14.49 IC4.39
PB7
  Top 0.152: IC1.17 7.62,8.89 12.68,13.95 IC4.43
PHI2  (via drill 0.3)
  Top 0.152: v21.59,11.43 HDR.25
  Bottom 0.152: HDR.25 v21.59,11.43
R/!W  (via drill 0.3)
  Top 0.152: HDR.22 v21.59,3.81
  Bottom 0.152: v21.59,3.81 HDR.22
REN
  Top 0.152: IC3.19 7.62,5.71 14.68,12.78 IC4.47
REN2
  Top 0.152: IC3.2 17.78,5.71 18.1,5.4 22.23,5.4 29.21,12.38 29.21,14.61 27.94,15.88 X2.18
ROM_SEL  (via drill 1)
  Top 0.152: 29.84,5.08 29.84,24.13 28.57,25.4 18.1,25.4 17.85,25.65 IC4.57 | 29.84,5.08 29.84,1.91 ROM.TP v26.67,1.27 | R3.1 29.84,5.08
  other vias: 29.21,1.27
SRQ
  Top 0.152: IC3.12 7.62,14.61 8.18,15.16 IC4.34
SRQ2
  Top 0.152: IC3.9 17.78,14.61 18.1,14.92 22.23,14.92 22.54,15.24 22.54,21.91 24.77,24.13 X2.11
T/!R  (via drill 0.3)
  Top 0.152: IC2.1 17.45,33.94 v17.45,29.84 17.13,29.53 IC4.64 | IC3.1 v17.46,4.45
  Bottom 0.152: v17.46,4.45 17.45,4.43 v17.45,29.84
TCK  (via drill 0.61)
  Top 0.152: IC4.30 6.56,22.65 6.67,22.54 6.67,21.27 6.03,20.64 5.08,20.64 4.76,20.32 TCK.TP
  other vias: 1.27,20.32
TDI  (via drill 0.3, 0.61)
  Top 0.152: IC4.28 6.5,23.65 v6.67,23.81
  Bottom 0.152: v6.67,23.81 5.71,24.77 5.71,25.08 5.08,25.72 1.59,25.72 TDI.TP
  other vias: 1.27,25.4
TDO  (via drill 0.3, 0.61)
  Top 0.152: IC4.53 16.36,23.65 v16.19,23.81
  Bottom 0.152: v16.19,23.81 13.34,23.81 7.3,17.78 TDO.TP
  other vias: 1.27,17.78
TMS  (via drill 0.61)
  Top 0.152: IC4.29 5.05,23.15 4.76,22.86 TMS.TP
  other vias: 1.27,22.86
VCC  (via drill 0.3)
  Top 0.152: IC3.11 7.62,17.09 v7.62,17.14 | R3.2 24.75,2.54 6.35,2.54
  Top 0.305: v15.88,20.32 15.24,20.95 14.61,20.95 v13.02,22.54 11.75,23.81 11.75,25.4 6.99,30.16 v6.99,34.92 IC2.20 | HDR.20 v2.54,1.27 6.35,1.27 6.35,2.54 6.35,4.39 IC3.20
  Bottom 0.152: v7.62,17.14 v13.02,22.54
  Bottom 0.305: HDR.20 v2.54,1.27 5.08,1.27 6.35,2.54 6.35,4.39 | VR1.3 9.12,33.02 C2.1 8.57,34.92 | 8.57,34.92 v6.99,34.92 7,34.94 C3.1.1 | 8.57,34.92 8.57,34.94 | v15.88,20.32 6.35,10.79 6.35,4.39 | C2.1.1 IC3.20 6.35,4.39

### Text on the board
tValues: GND